# Altium schematic sheet Phase 3.SchDoc (part 1 of 4)
size Tabloid; SheetNumber: 5; SheetTotal: 7
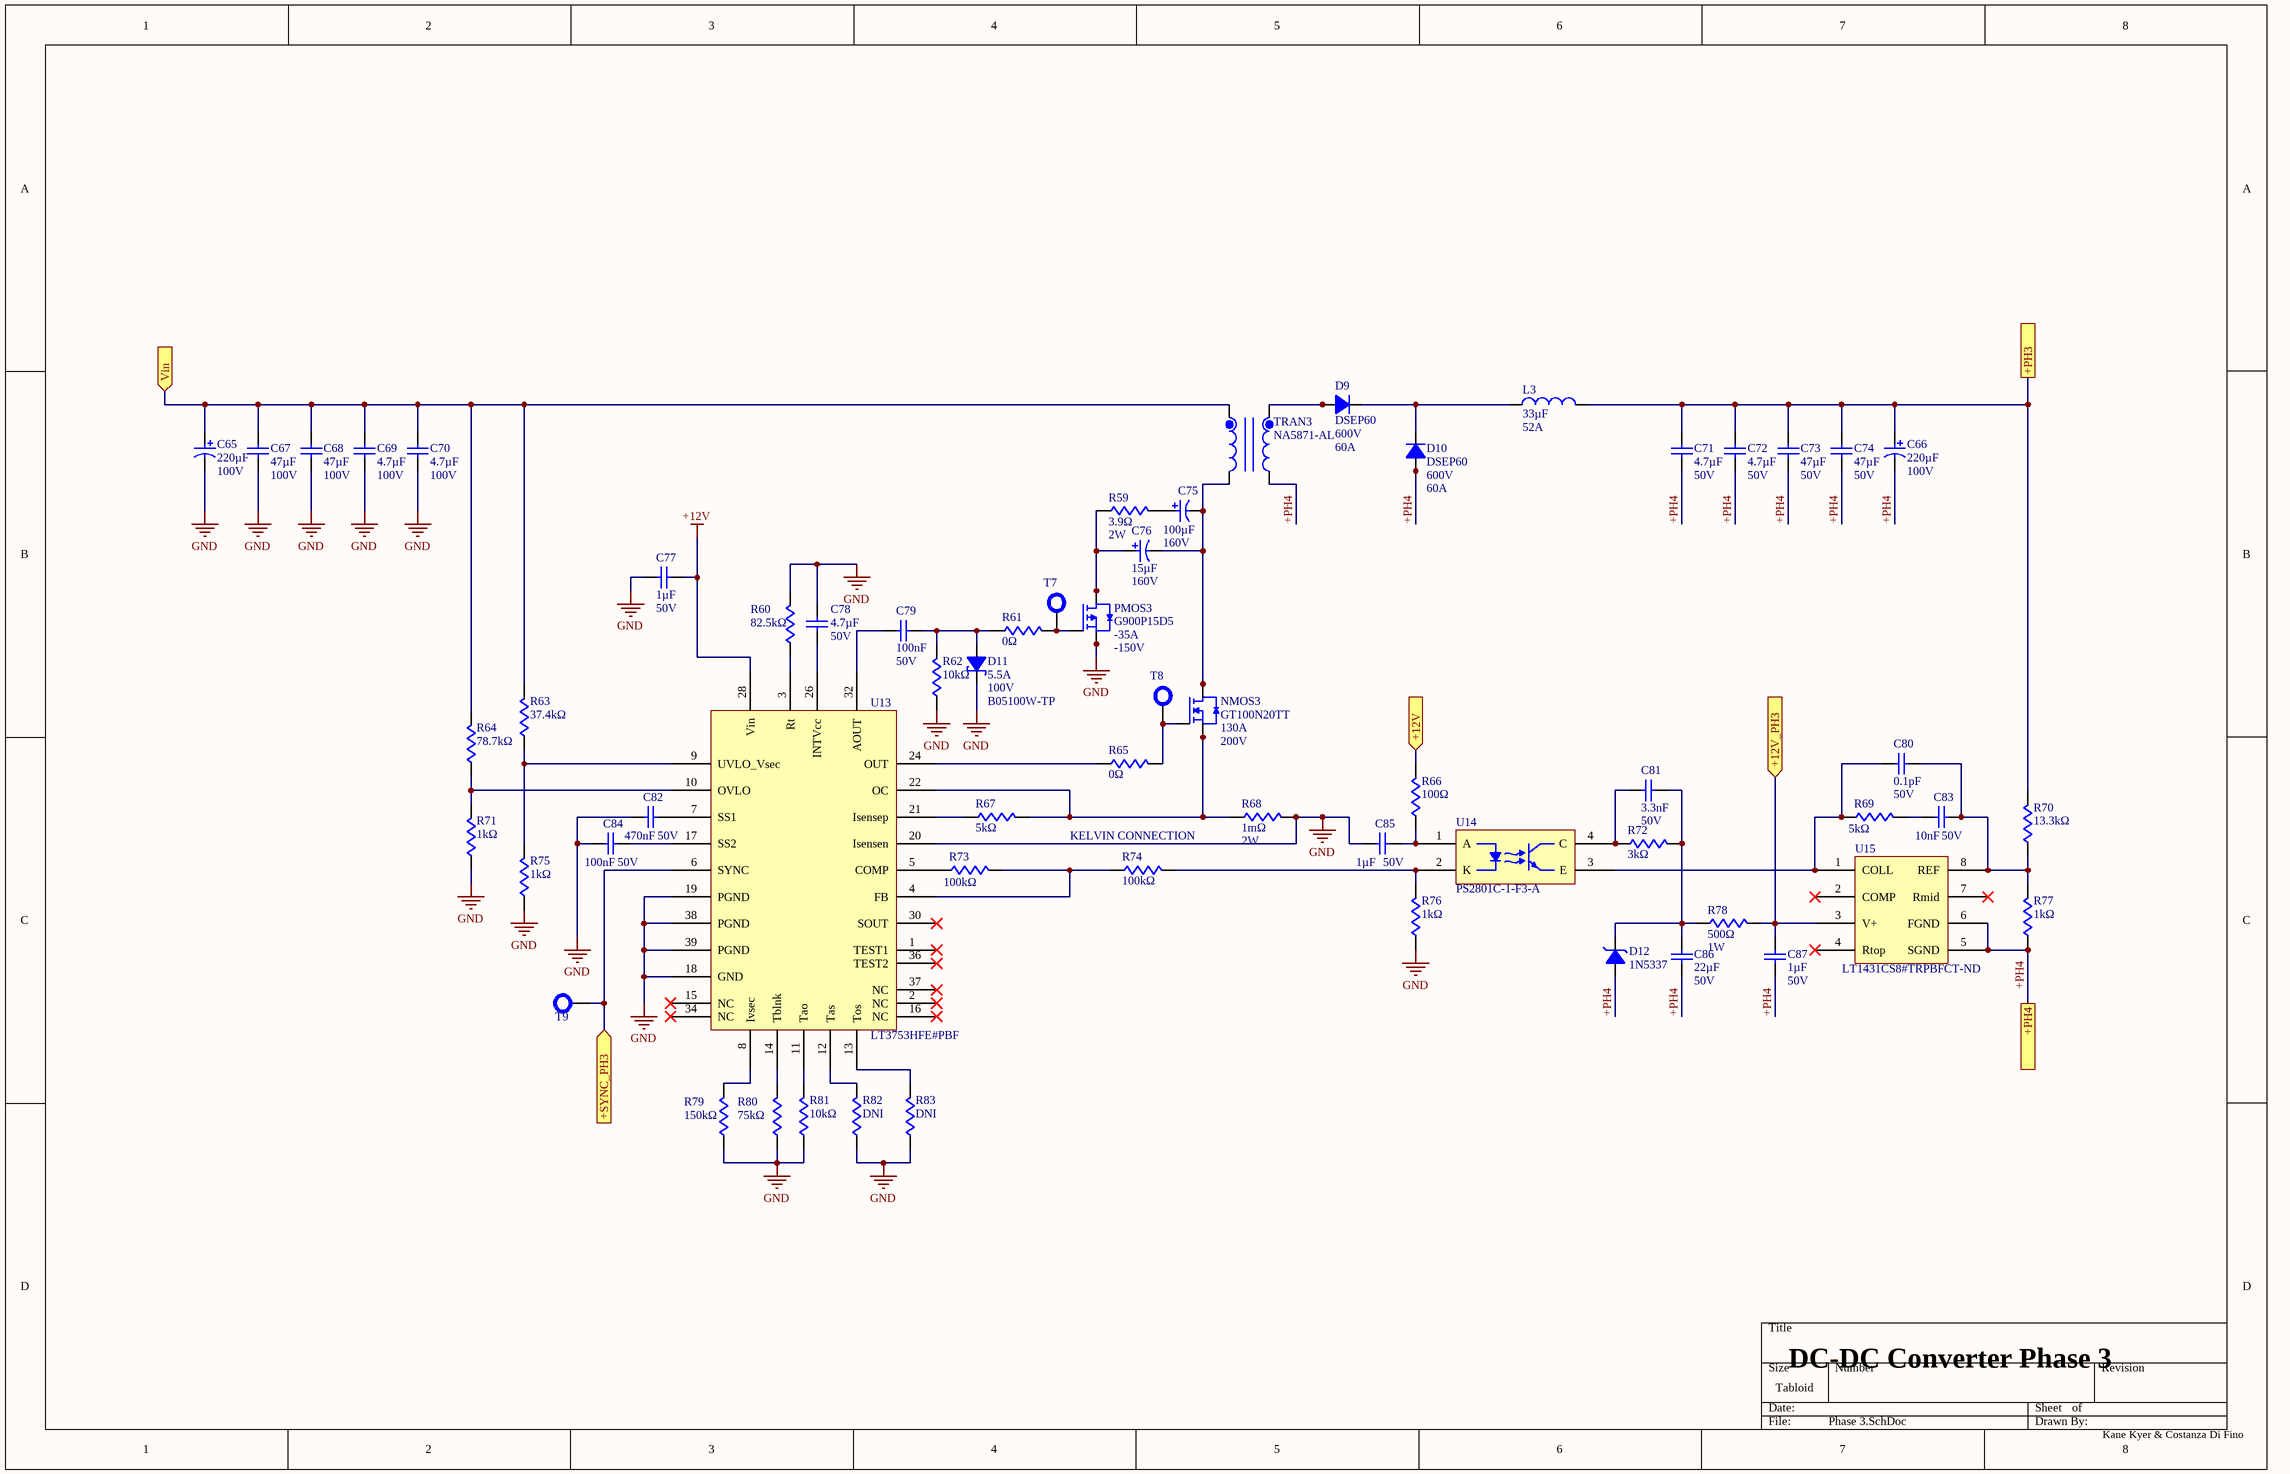
[diagram p0: Phase 3.SchDoc]

## Parts
C65  value 220µF  Voltage Rating: 100V  [C_AEC]  (hidden comment: AFK227M2AR44T-F)
C66  value 220µF  Voltage Rating: 100V  [C_AEC]  (hidden comment: AFK227M2AR44T-F)
C67  value 47µF  Voltage Rating: 100V  [C_CAA573]  (hidden comment: CAA573X7S2A476M640LH)
C68  value 47µF  Voltage Rating: 100V  [C_CAA573]  (hidden comment: CAA573X7S2A476M640LH)
C69  value 4.7µF  Voltage Rating (DC): 100V  [C_1210]  (hidden comment: GMC32X7S475K100NT)
C70  value 4.7µF  Voltage Rating (DC): 100V  [C_1210]  (hidden comment: GMC32X7S475K100NT)
C71  value 4.7µF  Voltage Rating (DC): 50V  [C_1206]  (hidden comment: GMC31X7R475K50NT)
C72  value 4.7µF  Voltage Rating (DC): 50V  [C_1206]  (hidden comment: GMC31X7R475K50NT)
C73  value 47µF  Voltage Rating (DC): 50V  [C_CKG57N]  (hidden comment: CKG57NX7R1H476M500JJ)
C74  value 47µF  Voltage Rating (DC): 50V  [C_CKG57N]  (hidden comment: CKG57NX7R1H476M500JJ)
C75  value 100µF  Voltage Rating (DC): 160V  [UUJ2C101MNJ1MS]  (hidden comment: UUJ2C101MNJ1MS)
C76  value 15µF  Voltage: 160V  [ULT2C150MNL1GS]  (hidden comment: ULT2C150MNL1GS)
C77  value 1µF  Voltage: 50V  [C_0805]  (hidden comment: CL21B105KBFNNNE)
C78  value 4.7µF  Voltage Rating (DC): 50V  [C_1206]  (hidden comment: GMC31X7R475K50NT)
C79  value 100nF  Voltage Rating: 50V  [C_0603]  (hidden comment: C0603C104K5RACTU)
C80  value 0.1pF  Voltage Rating: 50V  [C_0402]  (hidden comment: GJM1555C1HR10WB01D)
C81  value 3.3nF  Voltage Rating: 50V  [C_0603]  (hidden comment: GCM1885C1H332FA16D)
C82  value 470nF  Voltage Rating: 50V  [C_0402]  (hidden comment: GRM155R61H474KE11D)
C83  value 10nF  Voltage Rating: 50V  [C_0603]  (hidden comment: C0603C103K5RACTU)
C84  value 100nF  Voltage Rating: 50V  [C_0603]  (hidden comment: C0603C104K5RACTU)
C85  value 1µF  Voltage: 50V  [C_0805]  (hidden comment: CL21B105KBFNNNE)
C86  value 22µF  Voltage Rating (DC): 50V  [C_2220]  (hidden comment: GMC55X7R226M50NT)
C87  value 1µF  Voltage: 50V  [C_0805]  (hidden comment: CL21B105KBFNNNE)
D9  DSEP60  Vr: 600V  Io: 60A  [D_DSEP60]
D10  DSEP60  Vr: 600V  Io: 60A  [D_DSEP60]
D11  Max Forward Surge Current (Ifsm): 5.5A  Min Breakdown Voltage: 100V  [D_B05100W]  (hidden comment: B05100W-TP)
D12  Supplier Part Number: 1N5337  [D_1N5337]  (hidden comment: 1N5337BRLG)
L3  value 33µF  Irms: 52A  [CPEX4141L-330MC]  (hidden comment: CPEX4141L-330MC)
NMOS3  Id: 130A  Vds: 200V  [GT100N20TT]  (hidden comment: GT100N20TT)
PMOS3  Id: -35A  Vds: -150V  [G900P15]  (hidden comment: G900P15D5)
R59  value 3.9Ω  Power Rating: 2W  [R_SM2W]  (hidden comment: SMW23R9JT)
R60  value 82.5kΩ  [R_0805]  (hidden comment: RMCF0805FT82K5)
R61  value 0Ω  [R_0805]  (hidden comment: CRCW08050000Z0EA)
R62  value 10kΩ  [R_0402]  (hidden comment: RM04F1002CT)
R63  value 37.4kΩ  [R_0603]  (hidden comment: RC0603FR-0737K4L)
R64  value 78.7kΩ  [R_0603]  (hidden comment: RC0603FR-0778K7L)
R65  value 0Ω  [R_0805]  (hidden comment: CRCW08050000Z0EA)
R66  value 100Ω  [R_0603]  (hidden comment: RC0603FR-07100RL)
R67  value 5kΩ  [R_0402]  (hidden comment: PNM0402E5001BST1)
R68  value 1mΩ  Power Rating: 2W  [R_2512]  (hidden comment: CRE2512-FZ-R001E-2)
R69  value 5kΩ  [R_0402]  (hidden comment: PNM0402E5001BST1)
R70  value 13.3kΩ  [R_0603]  (hidden comment: RMCF0603FT13K3)
R71  value 1kΩ  [R_0402]  (hidden comment: RM04F1001CT)
R72  value 3kΩ  [C_0402]  (hidden comment: AC0402FR-073KL)
R73  value 100kΩ  [R_0402]  (hidden comment: RM04F1003CT)
R74  value 100kΩ  [R_0402]  (hidden comment: RM04F1003CT)
R75  value 1kΩ  [R_0402]  (hidden comment: RM04F1001CT)
R76  value 1kΩ  [R_0402]  (hidden comment: RM04F1001CT)
R77  value 1kΩ  [R_0402]  (hidden comment: RM04F1001CT)
R78  value 500Ω  Power Rating: 1W  [R_WSC2515]  (hidden comment: WSC2515500R0FEB)
R79  value 150kΩ  [R_0603]  (hidden comment: RC0603FR-07150KL)
R80  value 75kΩ  [R_0603]  (hidden comment: AC0603FR-0775KL)
R81  value 10kΩ  [R_0402]  (hidden comment: RM04F1002CT)
R82  value DNI  [R_0805]  (hidden comment: CRCW08050000Z0EA)
R83  value DNI  [R_0805]  (hidden comment: CRCW08050000Z0EA)
T7  TEST  [TEST_POINT]  (value not drawn)
T8  TEST  [TEST_POINT]  (value not drawn)
T9  TEST  [TEST_POINT]  (value not drawn)
TRAN3  NA5871-AL  [NA5871-AL]
U13  LT3753HFE#PBF  [LT3753]
U14  PS2801C-1-F3-A  [PS2801C]
U15  Supplier Part Number: LT1431CS8#TRPBFCT-ND  [LT1431]  (hidden comment: LT1431CS8#TRPBF)

## Ports
+12V (in, see SHEET_MAP[4C], Externals[2A], Phase 1[4C], Phase 2[4C], Phase 4[4C], Phase 5[4B]), +12V_PH3 (in, see SHEET_MAP[4C], Externals[6B]), +PH3 (see SHEET_MAP[4B], Externals[4C], Phase 2[6C]), +PH4 (see SHEET_MAP[4C], Externals[6B], Phase 4[6B]), +SYNC_PH3 (in, see SHEET_MAP[4C], Externals[3C]), Vin (in, see SHEET_MAP[4B], Externals[1A], Phase 1[1B], Phase 2[1B], Phase 4[1B], Phase 5[1B])

## Nets
+12V: C77.2 U13.28(Vin)
GND: C65.2 C67.1 C68.1 C69.1 C70.1 C77.1 C78.1 C82.1 C84.1 C85.1 D11.1 PMOS3.1(S) PMOS3.2(S) PMOS3.3(S) R60.2 R62.1 R68.2 R71.1 R75.1 R76.1 R79.1 R80.1 R81.1 R82.1 R83.1 U13.18(GND) U13.19(PGND) U13.20(Isensen) U13.38(PGND) U13.39(PGND)
+12V: R66.2 ; port +12V  [a separate net that carries the same name]
+12V_PH3: C87.2 R78.2 U15.3(V+) ; port +12V_PH3
+PH3: C66.1 C71.2 C72.2 C73.2 C74.2 L3.2 R70.2 ; port +PH3
+PH4: C66.2 C71.1 C72.1 C73.1 C74.1 C86.1 C87.1 D10.1(A) D10.3(A) D12.2 R77.1 TRAN3.11 U15.5(SGND) U15.6(FGND) ; port +PH4
+SYNC_PH3: T9.1 U13.6(SYNC) ; port +SYNC_PH3
Vin: C65.1 C67.2 C68.2 C69.2 C70.2 R63.2 R64.2 TRAN3.1 ; port Vin
NetC75_1: C75.1 R59.2
NetC75_2: C75.2 C76.2 NMOS3.9(D) NMOS3.10(D) NMOS3.11(D) NMOS3.12(D) NMOS3.13(D) NMOS3.14(D) NMOS3.15(D) NMOS3.16(D) TRAN3.4
NetC76_1: C76.1 PMOS3.5(D) PMOS3.6(D) PMOS3.7(D) PMOS3.8(D) R59.1
NetC78_2: C78.2 U13.26(INTVcc)
NetC79_1: C79.1 U13.32(AOUT)
NetC79_2: C79.2 D11.2 R61.1 R62.2
NetC80_1: C80.1 R69.1 U14.3(E) U15.1(COLL)
NetC80_2: C80.2 C83.2 R70.1 R77.2 U15.8(REF)
NetC81_1: C81.1 R72.1 U14.4(C)
NetC81_2: C81.2 C86.2 D12.1 R72.2 R78.1
NetC82_2: C82.2 U13.7(SS1)
NetC83_1: C83.1 R69.2
NetC84_2: C84.2 U13.17(SS2)
NetC85_2: C85.2 R66.1 U14.1(A)
NetD9_1: D9.1(A) D9.3(A) TRAN3.6
NetD9_4: D9.4(C) D10.4(C) L3.1
NetNMOS3_1: NMOS3.1(S) NMOS3.2(S) NMOS3.3(S) NMOS3.4(S) NMOS3.5(S) NMOS3.6(S) NMOS3.7(S) R67.2 R68.1 U13.22(OC)
NetNMOS3_8: NMOS3.8(G) R65.2 T8.1
NetPMOS3_4: PMOS3.4(G) R61.2 T7.1
NetR60_1: R60.1 U13.3(Rt)
NetR63_1: R63.1 R75.2 U13.9(UVLO_Vsec)
NetR64_1: R64.1 R71.2 U13.10(OVLO)
NetR65_1: R65.1 U13.24(OUT)
NetR67_1: R67.1 U13.21(Isensep)
NetR73_1: R73.1 U13.5(COMP)
NetR73_2: R73.2 R74.1 U13.4(FB)
NetR74_2: R74.2 R76.2 U14.2(K)
NetR79_2: R79.2 U13.8(Ivsec)
NetR80_2: R80.2 U13.14(Tblnk)
NetR81_2: R81.2 U13.11(Tao)
NetR82_2: R82.2 U13.12(Tas)
NetR83_2: R83.2 U13.13(Tos)

Not connected (* = marked no-connect by the designer): U13 1(TEST1)* 2(NC)* 15(NC)* 16(NC)* 30(SOUT)* 34(NC)* 36(TEST2)* 37(NC)*; U15 2(COMP)* 4(Rtop)* 7(Rmid)*

## Notes on the sheet
- (near R74) KELVIN CONNECTION
- DC-DC Converter Phase 3
- Kane Kyer & Costanza Di Fino
## Library data of the parts
C65 C66 = AFK227M2AR44T-F: Radial Can - SMD ALUMINUM ELECTROLYTIC CAPACITOR AFK 100V 220muF ±20% 0.709Dia 18.00mm; Manufacturer: Cornell Dubilier; Dissipation Factor: 0.07%; ESR (Equivalent Series Resistance): 150mΩ; Leakage Current: 220µA; Life (Hours): 5000hours; Ripple Current: 687.75mA; Ripple Current (AC): 917mA; Supplier: DigiKey; Supplier Part Number: 338-2172-1-ND; Manufacturer Part Number: AFK227M2AR44T-F; RoHS: Compliant; Category: Aluminum Electrolytic Capacitors; Stock: 15469; Pricing: 1=5.21, 10=3.565, 50=2.9248 (USD); Case/Package: Radial; Diameter: 18mm; Height: 16.5mm; Height - Seated (Max): 16.51mm; Impedance: 150mΩ; Lead Pitch: 6.7mm; Length: 21mm; Lifecycle Status: Production; Max Operating Temperature: 105°C; Min Operating Temperature: -55°C; Mounting Technology: Surface Mount; Number of Terminals: 2; Packaging: Tape & Reel; Radiation Hardening: No; REACH SVHC: Yes; Schedule B: 8532220020, 8532220020|8532220020|8532220020|8532220020|8532220020; Termination: SMD/SMT; Tolerance: 20%; Voltage Rating (DC): 100V; Width: 19mm; ComponentLink1URL: https://datasheet.octopart.com:443/AFK227M2AR44T-F-Cornell-Dubilier-datasheet-166322649.pdf?src-supplier=Master+Electronics; ComponentLink1Description: https://datasheet.octopart.com:443/AFK227M2AR44T-F-Cornell-Dubilier-datasheet-166322649.pdf?src-supplier=Master+Electronics; ComponentLink2URL: https://datasheet.octopart.com:443/AFK227M2AR44T-F-Cornell-Dubilier-datasheet-138156812.pdf?src-supplier=Master+Electronics; ComponentLink2Description: https://datasheet.octopart.com:443/AFK227M2AR44T-F-Cornell-Dubilier-datasheet-138156812.pdf?src-supplier=Master+Electronics; ComponentLink3URL: https://datasheet.octopart.com:443/AFK227M2AR44T-F-Cornell-Dubilier-datasheet-142087090.pdf?src-supplier=JRH+Electronics; ComponentLink3Description: https://datasheet.octopart.com:443/AFK227M2AR44T-F-Cornell-Dubilier-datasheet-142087090.pdf?src-supplier=JRH+Electronics; ComponentLink4URL: https://datasheet.octopart.com:443/AFK227M2AR44T-F-Cornell-Dubilier-datasheet-8399120.pdf?src-supplier=Newark; ComponentLink4Description: https://datasheet.octopart.com:443/AFK227M2AR44T-F-Cornell-Dubilier-datasheet-8399120.pdf?src-supplier=Newark; ComponentLink5URL: https://datasheet.octopart.com:443/AFK227M2AR44T-F-Cornell-Dubilier-datasheet-500115.pdf?src-supplier=Newark; ComponentLink5Description: https://datasheet.octopart.com:443/AFK227M2AR44T-F-Cornell-Dubilier-datasheet-500115.pdf?src-supplier=Newark; ComponentLink6URL: https://datasheet.octopart.com:443/AFK227M2AR44T-F-Cornell-Dubilier-datasheet-32747259.pdf?src-supplier=Newark; ComponentLink6Description: https://datasheet.octopart.com:443/AFK227M2AR44T-F-Cornell-Dubilier-datasheet-32747259.pdf?src-supplier=Newark; ComponentLink7URL: https://datasheet.octopart.com:443/AFK227M2AR44T-F-Cornell-Dubilier-datasheet-151943046.pdf?src-supplier=RS+(Formerly+Allied+Electronics); ComponentLink7Description: https://datasheet.octopart.com:443/AFK227M2AR44T-F-Cornell-Dubilier-datasheet-151943046.pdf?src-supplier=RS+(Formerly+Allied+Electronics); ComponentLink8URL: https://datasheet.octopart.com:443/AFK227M2AR44T-F-Cornell-Dubilier-datasheet-140352836.pdf?src-supplier=Sager+Electronics; ComponentLink8Description: https://datasheet.octopart.com:443/AFK227M2AR44T-F-Cornell-Dubilier-datasheet-140352836.pdf?src-supplier=Sager+Electronics; ComponentLink9URL: https://datasheet.octopart.com:443/AFK227M2AR44T-F-Cornell-Dubilier-datasheet-67811900.pdf?src-supplier=Sager+Electronics; ComponentLink9Description: https://datasheet.octopart.com:443/AFK227M2AR44T-F-Cornell-Dubilier-datasheet-67811900.pdf?src-supplier=Sager+Electronics; ComponentLink10URL: http://sigma.octopart.com:80/conflict_mineral_statement/Cornell-Dubilier-company-37.pdf?src-supplier=Compliance+Statements; ComponentLink10Description: http://sigma.octopart.com:80/conflict_mineral_statement/Cornell-Dubilier-company-37.pdf?src-supplier=Compliance+Statements
C67 C68 = CAA573X7S2A476M640LH: Multilayer Ceramic Chip Capacitors, Capacitance=47μF, LxWxT: 6.0x7.5x6.4mm; Manufacturer: TDK; Manufacturer Lifecycle Status: PRODUCTION; Tolerance: 20%; Supplier: DigiKey; Supplier Part Number: 445-CAA573X7S2A476M640LHDKR-ND; Manufacturer Part Number: CAA573X7S2A476M640LH; RoHS: Compliant; Category: Ceramic Capacitors; Stock: 24473; Pricing: 1=10.27, 10=7.818, 50=6.838, 100=6.579 (USD); China RoHS: Compliant; Dielectric Material: Ceramic; Height: 6.4mm; Length: 6mm; Lifecycle Status: Production; Material: Ceramic; Max Length: 6.5mm; Max Operating Temperature: 125°C; Max Width: 8mm; Min Length: 5.5mm; Min Operating Temperature: -55°C; Min Width: 7mm; Mounting Technology: Surface Mount; Number of Terminals: 2; REACH SVHC: Yes; Voltage Rating (DC): 100V; Width: 7.5mm; ComponentLink1URL: https://datasheet.octopart.com:443/CAA573X7S2A476M640LH-TDK-datasheet-182135103.pdf?src-supplier=IHS; ComponentLink1Description: https://datasheet.octopart.com:443/CAA573X7S2A476M640LH-TDK-datasheet-182135103.pdf?src-supplier=IHS; ComponentLink2URL: https://datasheet.octopart.com:443/CAA573X7S2A476M640LH-TDK-datasheet-155377011.pdf?src-supplier=TDK; ComponentLink2Description: https://datasheet.octopart.com:443/CAA573X7S2A476M640LH-TDK-datasheet-155377011.pdf?src-supplier=TDK; ComponentLink3URL: https://datasheet.octopart.com:443/CAA573X7S2A476M640LH-TDK-datasheet-153441511.pdf?src-supplier=Newark; ComponentLink3Description: https://datasheet.octopart.com:443/CAA573X7S2A476M640LH-TDK-datasheet-153441511.pdf?src-supplier=Newark; ComponentLink4URL: https://datasheet.octopart.com:443/CAA573X7S2A476M640LH-TDK-datasheet-168137603.pdf?src-supplier=TME; ComponentLink4Description: https://datasheet.octopart.com:443/CAA573X7S2A476M640LH-TDK-datasheet-168137603.pdf?src-supplier=TME
C69 C70 = GMC32X7S475K100NT: Ceramic Capacitor, Multilayer, Ceramic, 100V, 10% +Tol, 10% -Tol, X7S, 22% TC, 4.7uF, Surface Mount, 1210; Manufacturer: Cal-Chip Electronics; Supplier: DigiKey; Supplier Part Number: 4713-GMC32X7S475K100NTCT-ND; Manufacturer Part Number: GMC32X7S475K100NT; RoHS: Compliant; Category: Ceramic Capacitors; Stock: 7871; Pricing: 1=0.78, 10=0.493, 50=0.3784, 100=0.3432, 500=0.28388, 1000=0.26553, 2000=0.25043, 3000=0.24286, 5000=0.23448, 7000=0.22958, 10000=0.22487, 12000=0.22264, 24000=0.21512, 25000=0.21472 (USD); China RoHS: Compliant; Country of Origin: Slovenia, South Korea, Taiwan; Dielectric Material: Ceramic; Export Control Classification Number (ECCN) Code: EAR99; Height: 2.8mm; Harmonized Tariff Schedule (HTS) Code: 8532.24.00.20; Introduction Date: 2022-02-23; Length: 3.2mm; Lifecycle Status: Production; Max Operating Temperature: 125°C; Min Operating Temperature: -55°C; Mounting Technology: Surface Mount; Number of Terminals: 2; REACH SVHC: Yes; Width: 2.5mm; ComponentLink1URL: https://datasheet.octopart.com:443/GMC32X7S475K100NT-Cal-Chip-Electronics-datasheet-182028817.pdf?src-supplier=IHS; ComponentLink1Description: https://datasheet.octopart.com:443/GMC32X7S475K100NT-Cal-Chip-Electronics-datasheet-182028817.pdf?src-supplier=IHS
C71 C72 C78 = GMC31X7R475K50NT: Ceramic Capacitor, Multilayer, Ceramic, 50V, 10% +Tol, 10% -Tol, X7R, 15% TC, 4.7uF, Surface Mount, 1206; Manufacturer: Cal-Chip Electronics; Supplier: DigiKey; Supplier Part Number: 4713-GMC31X7R475K50NTCT-ND; Manufacturer Part Number: GMC31X7R475K50NT; RoHS: Compliant; Category: Ceramic Capacitors; Stock: 34176; Pricing: 1=0.3, 10=0.176, 50=0.128, 100=0.1133, 500=0.08864, 1000=0.08105 (USD); China RoHS: Compliant; Country of Origin: Slovenia, South Korea, Taiwan; Dielectric Material: Ceramic; Export Control Classification Number (ECCN) Code: EAR99; Height: 1.9mm; Harmonized Tariff Schedule (HTS) Code: 8532.24.00.20; Introduction Date: 2018-03-20; Length: 3.2mm; Lifecycle Status: Production; Max Operating Temperature: 125°C; Min Operating Temperature: -55°C; Mounting Technology: Surface Mount; Number of Terminals: 2; REACH SVHC: Yes; Width: 1.6mm; ComponentLink1URL: https://datasheet.octopart.com:443/GMC31X7R475K50NT-Cal-Chip-Electronics-datasheet-182028815.pdf?src-supplier=IHS; ComponentLink1Description: https://datasheet.octopart.com:443/GMC31X7R475K50NT-Cal-Chip-Electronics-datasheet-182028815.pdf?src-supplier=IHS
C73 C74 = CKG57NX7R1H476M500JJ: Ceramic Capacitor, Multilayer, Ceramic, 50V, 20% +Tol, 20% -Tol, X7R, 15% TC, 47uF, Surface Mount, 2420; Manufacturer: TDK; Manufacturer Lifecycle Status: PRODUCTION; Supplier: DigiKey; Supplier Part Number: 445-CKG57NX7R1H476M500JJCT-ND; Manufacturer Part Number: CKG57NX7R1H476M500JJ; RoHS: Compliant; Category: Ceramic Capacitors; Stock: 11597; Pricing: 1=9.3, 10=7.032, 50=6.1256, 100=5.845, 500=5.8293 (USD); China RoHS: Compliant; Dielectric Material: Ceramic; Height: 5mm; Length: 6mm; Lifecycle Status: Production; Max Length: 6.5mm; Max Operating Temperature: 125°C; Max Width: 5.5mm; Min Length: 5.5mm; Min Operating Temperature: -55°C; Min Width: 4.5mm; Mounting Technology: Surface Mount; Number of Terminals: 2; REACH SVHC: Yes; Width: 5mm; ComponentLink1URL: https://datasheet.octopart.com:443/CKG57NX7R1H476M500JJ-TDK-datasheet-181961982.pdf?src-supplier=IHS; ComponentLink1Description: https://datasheet.octopart.com:443/CKG57NX7R1H476M500JJ-TDK-datasheet-181961982.pdf?src-supplier=IHS; ComponentLink2URL: https://datasheet.octopart.com:443/CKG57NX7R1H476M500JJ-TDK-datasheet-151651377.pdf?src-supplier=Future+Electronics; ComponentLink2Description: https://datasheet.octopart.com:443/CKG57NX7R1H476M500JJ-TDK-datasheet-151651377.pdf?src-supplier=Future+Electronics; ComponentLink3URL: https://datasheet.octopart.com:443/CKG57NX7R1H476M500JJ-TDK-datasheet-182135362.pdf?src-supplier=TME; ComponentLink3Description: https://datasheet.octopart.com:443/CKG57NX7R1H476M500JJ-TDK-datasheet-182135362.pdf?src-supplier=TME; ComponentLink4URL: https://datasheet.octopart.com:443/CKG57NX7R1H476M500JJ-TDK-datasheet-165812700.pdf?src-supplier=ODG+(Origin+Data+Global); ComponentLink4Description: https://datasheet.octopart.com:443/CKG57NX7R1H476M500JJ-TDK-datasheet-165812700.pdf?src-supplier=ODG+(Origin+Data+Global)
C75 = UUJ2C101MNJ1MS: Aluminum Electrolytic Capacitors 100 F 160 V Radial, SMD 5000 Hrs 105C; Manufacturer: Nichicon; Leakage Current: 740µA; Ripple Current: 380mA; Supplier: DigiKey; Supplier Part Number: 493-UUJ2C101MNJ1MSCT-ND; Manufacturer Part Number: UUJ2C101MNJ1MS; RoHS: Compliant; Category: Aluminum Electrolytic Capacitors; Stock: 7193; Pricing: 1=2.95, 10=1.68 (USD); China RoHS: Compliant; Diameter: 16mm; Height: 21.5mm; Length: 17.1mm; Lifecycle Status: Production; Max Operating Temperature: 105°C; Min Operating Temperature: -40°C; Mounting Technology: Surface Mount; Number of Terminals: 2; REACH SVHC: No; Width: 17.1mm; ComponentLink1URL: https://datasheet.octopart.com:443/UUJ2C101MNJ1MS-Nichicon-datasheet-169250491.pdf?src-supplier=IHS; ComponentLink1Description: https://datasheet.octopart.com:443/UUJ2C101MNJ1MS-Nichicon-datasheet-169250491.pdf?src-supplier=IHS
C76 = ULT2C150MNL1GS: Radial Can - SMD ALUMINUM ELECTROLYTIC CAPACITOR ULT 160V 15muF ±20% 0.315Dia 8.00mm; Manufacturer: Nichicon; Leakage Current: 196µA; Life (Hours): 2000hours; Polarity: Polar; Ripple Current: 45mA; Supplier: DigiKey; Supplier Part Number: 493-6717-1-ND; Manufacturer Part Number: ULT2C150MNL1GS; RoHS: Compliant; Category: Aluminum Electrolytic Capacitors; Stock: 26934; Pricing: 1=0.99, 10=0.603, 50=0.4768, 100=0.4287 (USD); Case/Package: SMD/SMT; China RoHS: Compliant; Diameter: 8mm; Height: 10mm; Height - Seated (Max): 10.3124mm; Lead Pitch: 3.1mm; Length: 8.3mm; Lifecycle Status: Production; Max Operating Temperature: 125°C; Min Operating Temperature: -40°C; Mounting Technology: Surface Mount; Number of Terminals: 2; REACH SVHC: No; Ripple Current (AC): 45mA; Schedule B: 8532220020; Termination: SMD/SMT; Tolerance: 20%; Voltage Rating: 160V; Voltage Rating (DC): 160V; Weight: 799.995193mg; Width: 8.3mm; ComponentLink1URL: https://datasheet.octopart.com:443/ULT2C150MNL1GS-Nichicon-datasheet-169691395.pdf?src-supplier=IHS; ComponentLink1Description: https://datasheet.octopart.com:443/ULT2C150MNL1GS-Nichicon-datasheet-169691395.pdf?src-supplier=IHS; ComponentLink2URL: https://datasheet.octopart.com:443/ULT2C150MNL1GS-Nichicon-datasheet-141421453.pdf?src-supplier=ODG+(Origin+Data+Global); ComponentLink2Description: https://datasheet.octopart.com:443/ULT2C150MNL1GS-Nichicon-datasheet-141421453.pdf?src-supplier=ODG+(Origin+Data+Global); ComponentLink3URL: https://datasheet.octopart.com:443/ULT2C150MNL1GS-Nichicon-datasheet-83187986.pdf?src-supplier=TME; ComponentLink3Description: https://datasheet.octopart.com:443/ULT2C150MNL1GS-Nichicon-datasheet-83187986.pdf?src-supplier=TME
C77 C85 C87 = CL21B105KBFNNNE: 50V 1uF X7R ±10% 0805 Multilayer Ceramic Capacitors MLCC - SMD/SMT ROHS; Manufacturer: Samsung Electro-Mechanics; Supplier: DigiKey; Supplier Part Number: 1276-1029-6-ND; Manufacturer Part Number: CL21B105KBFNNNE; RoHS: Compliant; Category: Ceramic Capacitors; Stock: 1737555; Pricing: 1=0.08, 10=0.013 (USD); Case/Package: 0805; Case Code (Imperial): 0805; Case Code (Metric): 2012; China RoHS: Compliant; Country of Origin: Mainland China, Philippines, South Korea; Depth: 1.25mm; Dielectric: X7R; Dielectric Material: Ceramic; Export Control Classification Number (ECCN) Code: EAR99; Height: 1.35mm; Harmonized Tariff Schedule (HTS) Code: 8532.24.00.20; Introduction Date: 2010-07-30; Length: 2mm; Lifecycle Status: Production; Material: Ceramic; Max Operating Temperature: 125°C; Min Operating Temperature: -55°C; Mounting Technology: Surface Mount; Number of Terminals: 2; Radiation Hardening: No; REACH SVHC: Yes; Schedule B: 8532240020, 8532240020|8532240020, 8532240020|8532240020|8532240020, 8532240020|8532240020|8532240020|8532240020; Thickness: 1.3462mm; Tolerance: 10%; Voltage Rating: 50V; Voltage Rating (DC): 50V; Width: 1.25mm; ComponentLink1URL: https://datasheet.octopart.com:443/CL21B105KBFNNNE-Samsung-Electro-Mechanics-datasheet-136482495.pdf?src-supplier=IHS; ComponentLink1Description: https://datasheet.octopart.com:443/CL21B105KBFNNNE-Samsung-Electro-Mechanics-datasheet-136482495.pdf?src-supplier=IHS; ComponentLink2URL: https://datasheet.octopart.com:443/CL21B105KBFNNNE-Samsung-Electro-Mechanics-datasheet-11733377.pdf?src-supplier=Future+Electronics; ComponentLink2Description: https://datasheet.octopart.com:443/CL21B105KBFNNNE-Samsung-Electro-Mechanics-datasheet-11733377.pdf?src-supplier=Future+Electronics; ComponentLink3URL: https://datasheet.octopart.com:443/CL21B105KBFNNNE-Samsung-Electro-Mechanics-datasheet-116891038.pdf?src-supplier=Future+Electronics; ComponentLink3Description: https://datasheet.octopart.com:443/CL21B105KBFNNNE-Samsung-Electro-Mechanics-datasheet-116891038.pdf?src-supplier=Future+Electronics; ComponentLink4URL: https://datasheet.octopart.com:443/CL21B105KBFNNNE-Samsung-Electro-Mechanics-datasheet-81462183.pdf?src-supplier=Future+Electronics; ComponentLink4Description: https://datasheet.octopart.com:443/CL21B105KBFNNNE-Samsung-Electro-Mechanics-datasheet-81462183.pdf?src-supplier=Future+Electronics; ComponentLink5URL: https://datasheet.octopart.com:443/CL21B105KBFNNNE-Samsung-datasheet-48647582.pdf?src-supplier=Future+Electronics; ComponentLink5Description: https://datasheet.octopart.com:443/CL21B105KBFNNNE-Samsung-datasheet-48647582.pdf?src-supplier=Future+Electronics; ComponentLink6URL: https://datasheet.octopart.com:443/CL21B105KBFNNNE-Samsung-datasheet-8326294.pdf?src-supplier=Future+Electronics; ComponentLink6Description: https://datasheet.octopart.com:443/CL21B105KBFNNNE-Samsung-datasheet-8326294.pdf?src-supplier=Future+Electronics; ComponentLink7URL: https://datasheet.octopart.com:443/CL21B105KBFNNNE-Samsung-Electro-Mechanics-datasheet-149045959.pdf?src-supplier=Future+Electronics; ComponentLink7Description: https://datasheet.octopart.com:443/CL21B105KBFNNNE-Samsung-Electro-Mechanics-datasheet-149045959.pdf?src-supplier=Future+Electronics; ComponentLink8URL: https://datasheet.octopart.com/CL21B105KBFNNNE-Samsung-Electro-Mechanics-datasheet-97040617.pdf; ComponentLink8Description: https://datasheet.octopart.com/CL21B105KBFNNNE-Samsung-Electro-Mechanics-datasheet-97040617.pdf; ComponentLink9URL: https://datasheet.octopart.com/CL21B105KBFNNNE-Samsung-Electro-Mechanics-datasheet-8324245.pdf; ComponentLink9Description: https://datasheet.octopart.com/CL21B105KBFNNNE-Samsung-Electro-Mechanics-datasheet-8324245.pdf; ComponentLink10URL: https://datasheet.octopart.com/General-Multilayer-Ceramic-Capacitors-Samsung-datasheet-family-111.pdf; ComponentLink10Description: https://datasheet.octopart.com/General-Multilayer-Ceramic-Capacitors-Samsung-datasheet-family-111.pdf; ComponentLink11URL: https://datasheet.octopart.com:443/CL21B105KBFNNNE-Samsung-datasheet-59220082.pdf?src-supplier=TME; ComponentLink11Description: https://datasheet.octopart.com:443/CL21B105KBFNNNE-Samsung-datasheet-59220082.pdf?src-supplier=TME; ComponentLink12URL: http://sigma.octopart.com:80/rohs_certificate/General-Multilayer-Ceramic-Capacitors-Samsung-family-110.pdf?src-supplier=Compliance+Statements; ComponentLink12Description: http://sigma.octopart.com:80/rohs_certificate/General-Multilayer-Ceramic-Capacitors-Samsung-family-110.pdf?src-supplier=Compliance+Statements; ComponentLink13URL: http://sigma.octopart.com:80/rohs_statement/General-Multilayer-Ceramic-Capacitors-Samsung-family-132.pdf?src-supplier=Compliance+Statements; ComponentLink13Description: http://sigma.octopart.com:80/rohs_statement/General-Multilayer-Ceramic-Capacitors-Samsung-family-132.pdf?src-supplier=Compliance+Statements; ComponentLink14URL: http://sigma.octopart.com:80/reach_statement/General-Multilayer-Ceramic-Capacitors-Samsung-family-133.pdf?src-supplier=Compliance+Statements; ComponentLink14Description: http://sigma.octopart.com:80/reach_statement/General-Multilayer-Ceramic-Capacitors-Samsung-family-133.pdf?src-supplier=Compliance+Statements
C79 C84 = C0603C104K5RACTU: 50V 100nF X7R ±10% 0603 Multilayer Ceramic Capacitors MLCC - SMD/SMT ROHS; Manufacturer: KEMET; Dissipation Factor: 2.5%; Temperature Coefficient: 30ppm/°C; Supplier: DigiKey; Supplier Part Number: 399-C0603C104K5RACTUCT-ND; Manufacturer Part Number: C0603C104K5RACTU; RoHS: Compliant; Category: Ceramic Capacitors; Stock: 12452103; Pricing: 1=0.08, 10=0.011 (USD); Case/Package: 0603; Case Code (Imperial): 0603; China RoHS: Compliant; Contact Plating: Tin; Country of Origin: Mexico; Depth: 800µm; Dielectric: X7R; Dielectric Material: Ceramic; Export Control Classification Number (ECCN) Code: EAR99; Height: 800µm; Harmonized Tariff Schedule (HTS) Code: 8532.24.00.20; Introduction Date: 2011-07-27; Lead Free: Lead Free; Lead Pitch: 700µm; Length: 1.6mm; Lifecycle Status: Production; Material: Ceramic; Max Operating Temperature: 125°C; Min Operating Temperature: -55°C; Mounting Technology: Surface Mount; Pins: 2; Number of Terminals: 2; Packaging: Tape & Reel; Radiation Hardening: No; REACH SVHC: Yes; Schedule B: 8532240020, 8532240020|8532240020, 8532240020|8532240020|8532240020, 8532240020|8532240020|8532240020|8532240020; Termination: SMD/SMT; Thickness: 863.6µm; Tolerance: 10%; Voltage: 50V; Voltage Rating (DC): 50V; Width: 800µm; ComponentLink1URL: https://datasheet.octopart.com:443/C0603C104K5RACTU-KEMET-datasheet-178445679.pdf?src-supplier=IHS; ComponentLink1Description: https://datasheet.octopart.com:443/C0603C104K5RACTU-KEMET-datasheet-178445679.pdf?src-supplier=IHS; ComponentLink2URL: https://datasheet.octopart.com:443/C0603C104K5RAC7867-KEMET-datasheet-184792804.pdf?src-supplier=IHS; ComponentLink2Description: https://datasheet.octopart.com:443/C0603C104K5RAC7867-KEMET-datasheet-184792804.pdf?src-supplier=IHS; ComponentLink3URL: https://datasheet.octopart.com:443/C0603C104K5RACTU-KEMET-datasheet-137357759.pdf?src-supplier=Farnell; ComponentLink3Description: https://datasheet.octopart.com:443/C0603C104K5RACTU-KEMET-datasheet-137357759.pdf?src-supplier=Farnell; ComponentLink4URL: https://datasheet.octopart.com:443/C0603C104K5RACTU-KEMET-datasheet-149521864.pdf?src-supplier=Farnell; ComponentLink4Description: https://datasheet.octopart.com:443/C0603C104K5RACTU-KEMET-datasheet-149521864.pdf?src-supplier=Farnell; ComponentLink5URL: https://datasheet.octopart.com:443/C0603C104K5RACTU-KEMET-datasheet-101575654.pdf?src-supplier=Farnell; ComponentLink5Description: https://datasheet.octopart.com:443/C0603C104K5RACTU-KEMET-datasheet-101575654.pdf?src-supplier=Farnell; ComponentLink6URL: https://datasheet.octopart.com:443/C0603C104K5RACTU-KEMET-datasheet-176142159.pdf?src-supplier=Farnell; ComponentLink6Description: https://datasheet.octopart.com:443/C0603C104K5RACTU-KEMET-datasheet-176142159.pdf?src-supplier=Farnell; ComponentLink7URL: https://datasheet.octopart.com:443/C0603C104K5RAC-TU-Kemet-datasheet-7833651.pdf?src-supplier=Farnell; ComponentLink7Description: https://datasheet.octopart.com:443/C0603C104K5RAC-TU-Kemet-datasheet-7833651.pdf?src-supplier=Farnell; ComponentLink8URL: https://datasheet.octopart.com:443/C0603C104K5RAC-TU-Kemet-datasheet-7601896.pdf?src-supplier=Farnell; ComponentLink8Description: https://datasheet.octopart.com:443/C0603C104K5RAC-TU-Kemet-datasheet-7601896.pdf?src-supplier=Farnell; ComponentLink9URL: https://datasheet.octopart.com:443/C0603C104K5RAC-TU-Kemet-datasheet-5316294.pdf?src-supplier=Farnell; ComponentLink9Description: https://datasheet.octopart.com:443/C0603C104K5RAC-TU-Kemet-datasheet-5316294.pdf?src-supplier=Farnell; ComponentLink10URL: https://datasheet.octopart.com:443/C0603C104K5RAC-TU-Kemet-datasheet-5314837.pdf?src-supplier=Farnell; ComponentLink10Description: https://datasheet.octopart.com:443/C0603C104K5RAC-TU-Kemet-datasheet-5314837.pdf?src-supplier=Farnell; ComponentLink11URL: https://datasheet.octopart.com:443/C0603C104K5RAC-TU-Kemet-datasheet-8092359.pdf?src-supplier=Farnell; ComponentLink11Description: https://datasheet.octopart.com:443/C0603C104K5RAC-TU-Kemet-datasheet-8092359.pdf?src-supplier=Farnell; ComponentLink12URL: https://datasheet.octopart.com:443/C0603C104K5RAC-TU-Kemet-datasheet-5314449.pdf?src-supplier=Farnell; ComponentLink12Description: https://datasheet.octopart.com:443/C0603C104K5RAC-TU-Kemet-datasheet-5314449.pdf?src-supplier=Farnell; ComponentLink13URL: https://datasheet.octopart.com:443/C0603C104K5RAC-TU-Kemet-datasheet-5314969.pdf?src-supplier=Farnell; ComponentLink13Description: https://datasheet.octopart.com:443/C0603C104K5RAC-TU-Kemet-datasheet-5314969.pdf?src-supplier=Farnell; ComponentLink14URL: https://datasheet.octopart.com:443/C0603C104K5RAC-TU-Kemet-datasheet-5314627.pdf?src-supplier=Farnell; ComponentLink14Description: https://datasheet.octopart.com:443/C0603C104K5RAC-TU-Kemet-datasheet-5314627.pdf?src-supplier=Farnell; ComponentLink15URL: https://datasheet.octopart.com:443/C0603C104K5RAC-TU-Kemet-datasheet-5389132.pdf?src-supplier=Farnell; ComponentLink15Description: https://datasheet.octopart.com:443/C0603C104K5RAC-TU-Kemet-datasheet-5389132.pdf?src-supplier=Farnell; ComponentLink16URL: https://datasheet.octopart.com:443/C0603C104K5RAC-TU-Kemet-datasheet-5313836.pdf?src-supplier=Farnell; ComponentLink16Description: https://datasheet.octopart.com:443/C0603C104K5RAC-TU-Kemet-datasheet-5313836.pdf?src-supplier=Farnell; ComponentLink17URL: https://datasheet.octopart.com:443/C0603C104K5RAC-TU-Kemet-datasheet-8111010.pdf?src-supplier=Farnell; ComponentLink17Description: https://datasheet.octopart.com:443/C0603C104K5RAC-TU-Kemet-datasheet-8111010.pdf?src-supplier=Farnell; ComponentLink18URL: https://datasheet.octopart.com:443/C0603C104K5RAC-TU-Kemet-datasheet-7627733.pdf?src-supplier=Farnell; ComponentLink18Description: https://datasheet.octopart.com:443/C0603C104K5RAC-TU-Kemet-datasheet-7627733.pdf?src-supplier=Farnell; ComponentLink19URL: https://datasheet.octopart.com:443/C0603C104K5RAC-TU-Kemet-datasheet-5315946.pdf?src-supplier=Farnell; ComponentLink19Description: https://datasheet.octopart.com:443/C0603C104K5RAC-TU-Kemet-datasheet-5315946.pdf?src-supplier=Farnell; ComponentLink20URL: https://datasheet.octopart.com:443/C0603C104K5RACTU-KEMET-datasheet-137357764.pdf?src-supplier=Upverter; ComponentLink20Description: https://datasheet.octopart.com:443/C0603C104K5RACTU-KEMET-datasheet-137357764.pdf?src-supplier=Upverter; ComponentLink21URL: https://datasheet.octopart.com:443/C0603C104K5RAC-TU-Kemet-datasheet-5313890.pdf?src-supplier=Newark; ComponentLink21Description: https://datasheet.octopart.com:443/C0603C104K5RAC-TU-Kemet-datasheet-5313890.pdf?src-supplier=Newark; ComponentLink22URL: https://datasheet.octopart.com:443/C0603C104K5RACTU-Kemet-datasheet-12608295.pdf?src-supplier=Newark; ComponentLink22Description: https://datasheet.octopart.com:443/C0603C104K5RACTU-Kemet-datasheet-12608295.pdf?src-supplier=Newark; ComponentLink23URL: https://datasheet.octopart.com:443/C0603C104K5RACTU-Kemet-datasheet-11992184.pdf?src-supplier=Newark; ComponentLink23Description: https://datasheet.octopart.com:443/C0603C104K5RACTU-Kemet-datasheet-11992184.pdf?src-supplier=Newark; ComponentLink24URL: https://datasheet.octopart.com:443/C0603C104K5RACTU-Kemet-datasheet-10942409.pdf?src-supplier=Newark; ComponentLink24Description: https://datasheet.octopart.com:443/C0603C104K5RACTU-Kemet-datasheet-10942409.pdf?src-supplier=Newark; ComponentLink25URL: https://datasheet.octopart.com:443/C0603C104K5RACTU-Kemet-datasheet-10404442.pdf?src-supplier=Newark; ComponentLink25Description: https://datasheet.octopart.com:443/C0603C104K5RACTU-Kemet-datasheet-10404442.pdf?src-supplier=Newark; ComponentLink26URL: https://datasheet.octopart.com:443/C0603C104K5RAC-TU-Kemet-datasheet-5390537.pdf?src-supplier=Newark; ComponentLink26Description: https://datasheet.octopart.com:443/C0603C104K5RAC-TU-Kemet-datasheet-5390537.pdf?src-supplier=Newark; ComponentLink27URL: https://datasheet.octopart.com:443/C0603C104K5RAC-TU-Kemet-datasheet-7541751.pdf?src-supplier=Newark; ComponentLink27Description: https://datasheet.octopart.com:443/C0603C104K5RAC-TU-Kemet-datasheet-7541751.pdf?src-supplier=Newark; ComponentLink28URL: https://datasheet.octopart.com:443/C0603C104K5RACTU-KEMET-datasheet-171829795.pdf?src-supplier=Newark; ComponentLink28Description: https://datasheet.octopart.com:443/C0603C104K5RACTU-KEMET-datasheet-171829795.pdf?src-supplier=Newark; ComponentLink29URL: https://datasheet.octopart.com:443/C0603C104K5RACTU-Kemet-datasheet-8764837.pdf?src-supplier=Newark; ComponentLink29Description: https://datasheet.octopart.com:443/C0603C104K5RACTU-Kemet-datasheet-8764837.pdf?src-supplier=Newark; ComponentLink30URL: https://datasheet.octopart.com:443/C0603C104K5RACTU-Kemet-datasheet-8480123.pdf?src-supplier=Newark; ComponentLink30Description: https://datasheet.octopart.com:443/C0603C104K5RACTU-Kemet-datasheet-8480123.pdf?src-supplier=Newark; ComponentLink31URL: https://datasheet.octopart.com:443/C0603C104K5RACTU-Kemet-datasheet-5393970.pdf?src-supplier=Newark; ComponentLink31Description: https://datasheet.octopart.com:443/C0603C104K5RACTU-Kemet-datasheet-5393970.pdf?src-supplier=Newark; ComponentLink32URL: https://datasheet.octopart.com:443/C0603C104K5RACTU-Kemet-datasheet-8502025.pdf?src-supplier=Newark; ComponentLink32Description: https://datasheet.octopart.com:443/C0603C104K5RACTU-Kemet-datasheet-8502025.pdf?src-supplier=Newark; ComponentLink33URL: https://datasheet.octopart.com:443/C0603C104K5RACTU-Kemet-datasheet-161801.pdf?src-supplier=Newark; ComponentLink33Description: https://datasheet.octopart.com:443/C0603C104K5RACTU-Kemet-datasheet-161801.pdf?src-supplier=Newark; ComponentLink34URL: https://datasheet.octopart.com:443/C0603C104K5RACTU-Kemet-datasheet-32036385.pdf?src-supplier=Electro+Sonic; ComponentLink34Description: https://datasheet.octopart.com:443/C0603C104K5RACTU-Kemet-datasheet-32036385.pdf?src-supplier=Electro+Sonic; ComponentLink35URL: https://datasheet.octopart.com:443/C0603C104K5RACTU-KEMET-datasheet-157246124.pdf?src-supplier=Electro+Sonic; ComponentLink35Description: https://datasheet.octopart.com:443/C0603C104K5RACTU-KEMET-datasheet-157246124.pdf?src-supplier=Electro+Sonic; ComponentLink36URL: https://datasheet.octopart.com:443/C0603C104K5RACTU-KEMET-datasheet-164512540.pdf?src-supplier=TME; ComponentLink36Description: https://datasheet.octopart.com:443/C0603C104K5RACTU-KEMET-datasheet-164512540.pdf?src-supplier=TME; ComponentLink37URL: https://datasheet.octopart.com:443/C0603C104K5RACTU-Kemet-datasheet-67830781.pdf?src-supplier=TME; ComponentLink37Description: https://datasheet.octopart.com:443/C0603C104K5RACTU-Kemet-datasheet-67830781.pdf?src-supplier=TME; ComponentLink38URL: https://datasheet.octopart.com:443/C0603C104K5RACTU-KEMET-datasheet-68331906.pdf?src-supplier=TME; ComponentLink38Description: https://datasheet.octopart.com:443/C0603C104K5RACTU-KEMET-datasheet-68331906.pdf?src-supplier=TME; ComponentLink39URL: https://datasheet.octopart.com:443/C0603C104K5RAC7867-Kemet-datasheet-62098571.pdf?src-supplier=TME; ComponentLink39Description: https://datasheet.octopart.com:443/C0603C104K5RAC7867-Kemet-datasheet-62098571.pdf?src-supplier=TME; ComponentLink40URL: https://datasheet.octopart.com:443/C0603C104K5RAC7867-Kemet-datasheet-17577222.pdf?src-supplier=TME; ComponentLink40Description: https://datasheet.octopart.com:443/C0603C104K5RAC7867-Kemet-datasheet-17577222.pdf?src-supplier=TME; ComponentLink41URL: https://datasheet.octopart.com:443/C0603C104K5RACTU-KEMET-datasheet-110724412.pdf?src-supplier=RS+(Formerly+Allied+Electronics); ComponentLink41Description: https://datasheet.octopart.com:443/C0603C104K5RACTU-KEMET-datasheet-110724412.pdf?src-supplier=RS+(Formerly+Allied+Electronics); ComponentLink42URL: https://datasheet.octopart.com:443/C0603C104K5RACTU-Kemet-datasheet-464.pdf?src-supplier=RS+(Formerly+Allied+Electronics); ComponentLink42Description: https://datasheet.octopart.com:443/C0603C104K5RACTU-Kemet-datasheet-464.pdf?src-supplier=RS+(Formerly+Allied+Electronics); ComponentLink43URL: https://datasheet.octopart.com/C0603C104K5RACTU-KEMET-datasheet-84169754.pdf; ComponentLink43Description: https://datasheet.octopart.com/C0603C104K5RACTU-KEMET-datasheet-84169754.pdf; ComponentLink44URL: https://datasheet.octopart.com:443/C0603C104K5RACTU-Kemet-datasheet-24570007.pdf?src-supplier=element14+APAC; ComponentLink44Description: https://datasheet.octopart.com:443/C0603C104K5RACTU-Kemet-datasheet-24570007.pdf?src-supplier=element14+APAC; ComponentLink45URL: https://datasheet.octopart.com:443/C0603C104K5RACTU-Kemet-datasheet-22084244.pdf?src-supplier=element14+APAC; ComponentLink45Description: https://datasheet.octopart.com:443/C0603C104K5RACTU-Kemet-datasheet-22084244.pdf?src-supplier=element14+APAC; ComponentLink46URL: https://datasheet.octopart.com:443/C0603C104K5RACTU-Kemet-datasheet-21389238.pdf?src-supplier=element14+APAC; ComponentLink46Description: https://datasheet.octopart.com:443/C0603C104K5RACTU-Kemet-datasheet-21389238.pdf?src-supplier=element14+APAC; ComponentLink47URL: https://datasheet.octopart.com:443/C0603C104K5RACTU-Kemet-datasheet-11723057.pdf?src-supplier=Arrow+Electronics; ComponentLink47Description: https://datasheet.octopart.com:443/C0603C104K5RACTU-Kemet-datasheet-11723057.pdf?src-supplier=Arrow+Electronics; ComponentLink48URL: https://datasheet.octopart.com:443/C0603C104K5RAC7867-KEMET-datasheet-164857143.pdf?src-supplier=Burklin+Elektronik; ComponentLink48Description: https://datasheet.octopart.com:443/C0603C104K5RAC7867-KEMET-datasheet-164857143.pdf?src-supplier=Burklin+Elektronik; ComponentLink49URL: https://datasheet.octopart.com:443/C0603C104K5RAC-TU-Kemet-datasheet-8187850.pdf?src-supplier=Jameco; ComponentLink49Description: https://datasheet.octopart.com:443/C0603C104K5RAC-TU-Kemet-datasheet-8187850.pdf?src-supplier=Jameco; ComponentLink50URL: https://datasheet.octopart.com:443/C0603C104K5RACTU-Kemet-datasheet-122295.pdf?src-supplier=DigiKey; ComponentLink50Description: https://datasheet.octopart.com:443/C0603C104K5RACTU-Kemet-datasheet-122295.pdf?src-supplier=DigiKey
C80 = GJM1555C1HR10WB01D: Multilayer Ceramic Capacitor, 0.1 pF, 50 V, ± 0.05pF, C0G (NP0), 0402 [1005 Metric]; Manufacturer: Murata; Manufacturer Lifecycle Status: IN PRODUCTION; Temperature Coefficient: 30ppm/°C; Supplier: DigiKey; Supplier Part Number: 490-11246-1-ND; Manufacturer Part Number: GJM1555C1HR10WB01D; RoHS: Compliant; Category: Ceramic Capacitors; Stock: 158749; Pricing: 1=0.13, 10=0.073, 50=0.0506, 100=0.044, 500=0.03276, 1000=0.02931, 2500=0.02674, 5000=0.02514 (USD); Case/Package: 0402; Case Code (Imperial): 0402; Case Code (Metric): 1005; Dielectric: C0G; Dielectric Material: Ceramic; Export Control Classification Number (ECCN) Code: EAR99; Height: 500µm; Harmonized Tariff Schedule (HTS) Code: 8532.24.00.20; Introduction Date: 2008-02-22; Lead Free: Lead Free; Length: 1mm; Lifecycle Status: Production; Material: Ceramic; Max Operating Temperature: 125°C; Min Operating Temperature: -55°C; Mounting Technology: Surface Mount; Number of Terminals: 2; REACH SVHC: Yes; Schedule B: 8532240020, 8532240020|8532240020|8532240020|8532240020|8532240020; Termination: SMD/SMT; Thickness: 500µm; Voltage Rating (DC): 50V; Width: 500µm; ComponentLink1URL: https://datasheet.octopart.com:443/GJM1555C1HR10WB01D-Murata-datasheet-14406295.pdf?src-supplier=Future+Electronics; ComponentLink1Description: https://datasheet.octopart.com:443/GJM1555C1HR10WB01D-Murata-datasheet-14406295.pdf?src-supplier=Future+Electronics; ComponentLink2URL: https://datasheet.octopart.com:443/GJM1555C1HR10WB01D-Murata-datasheet-22122223.pdf?src-supplier=Future+Electronics; ComponentLink2Description: https://datasheet.octopart.com:443/GJM1555C1HR10WB01D-Murata-datasheet-22122223.pdf?src-supplier=Future+Electronics; ComponentLink3URL: https://datasheet.octopart.com:443/GJM1555C1HR10WB01D-Murata-datasheet-44104974.pdf?src-supplier=Future+Electronics; ComponentLink3Description: https://datasheet.octopart.com:443/GJM1555C1HR10WB01D-Murata-datasheet-44104974.pdf?src-supplier=Future+Electronics; ComponentLink4URL: https://datasheet.octopart.com:443/GJM1555C1HR10WB01D-Murata-datasheet-165579666.pdf?src-supplier=TME; ComponentLink4Description: https://datasheet.octopart.com:443/GJM1555C1HR10WB01D-Murata-datasheet-165579666.pdf?src-supplier=TME; ComponentLink5URL: https://datasheet.octopart.com:443/GJM1555C1HR10WB01D-Murata-datasheet-141271456.pdf?src-supplier=Ciiva; ComponentLink5Description: https://datasheet.octopart.com:443/GJM1555C1HR10WB01D-Murata-datasheet-141271456.pdf?src-supplier=Ciiva; ComponentLink6URL: https://datasheet.octopart.com:443/GJM1555C1HR10WB01D-Murata-datasheet-140665776.pdf?src-supplier=Ciiva; ComponentLink6Description: https://datasheet.octopart.com:443/GJM1555C1HR10WB01D-Murata-datasheet-140665776.pdf?src-supplier=Ciiva; ComponentLink7URL: https://datasheet.octopart.com:443/GJM1555C1HR10WB01D-Murata-datasheet-138725146.pdf?src-supplier=Ciiva; ComponentLink7Description: https://datasheet.octopart.com:443/GJM1555C1HR10WB01D-Murata-datasheet-138725146.pdf?src-supplier=Ciiva; ComponentLink8URL: https://datasheet.octopart.com/GJM1555C1HR10WB01D-Murata-datasheet-12515295.pdf; ComponentLink8Description: https://datasheet.octopart.com/GJM1555C1HR10WB01D-Murata-datasheet-12515295.pdf; ComponentLink9URL: https://datasheet.octopart.com/GJM1555C1HR10WB01D-Murata-datasheet-12510076.pdf; ComponentLink9Description: https://datasheet.octopart.com/GJM1555C1HR10WB01D-Murata-datasheet-12510076.pdf; ComponentLink10URL: https://datasheet.octopart.com/GJM1555C1HR10WB01D-Murata-datasheet-11978611.pdf; ComponentLink10Description: https://datasheet.octopart.com/GJM1555C1HR10WB01D-Murata-datasheet-11978611.pdf; ComponentLink11URL: https://datasheet.octopart.com/GJM1555C1HR10WB01D-Murata-datasheet-10025737.pdf; ComponentLink11Description: https://datasheet.octopart.com/GJM1555C1HR10WB01D-Murata-datasheet-10025737.pdf; ComponentLink12URL: https://datasheet.octopart.com/GJM1555C1HR10WB01D-Murata-datasheet-8819587.pdf; ComponentLink12Description: https://datasheet.octopart.com/GJM1555C1HR10WB01D-Murata-datasheet-8819587.pdf; ComponentLink13URL: http://sigma.octopart.com:80/reach_statement/Murata-company-16.pdf?src-supplier=Compliance+Statements; ComponentLink13Description: http://sigma.octopart.com:80/reach_statement/Murata-company-16.pdf?src-supplier=Compliance+Statements
C81 = GCM1885C1H332FA16D: 50V 3.3nF C0G ±1% 0603 Multilayer Ceramic Capacitors MLCC - SMD/SMT ROHS; Manufacturer: Murata; Manufacturer Lifecycle Status: IN PRODUCTION; Temperature Coefficient: 30ppm/°C; Supplier: DigiKey; Supplier Part Number: 490-GCM1885C1H332FA16DCT-ND; Manufacturer Part Number: GCM1885C1H332FA16D; RoHS: Compliant; Category: Ceramic Capacitors; Stock: 289814; Pricing: 1=0.18, 10=0.102, 50=0.072, 100=0.063, 500=0.04778, 1000=0.04311 (USD); Case/Package: 0603; Dielectric Material: Ceramic; Export Control Classification Number (ECCN) Code: EAR99; Height: 800µm; Harmonized Tariff Schedule (HTS) Code: 8532.24.00.20; Introduction Date: 2013-11-20; Length: 1.6mm; Lifecycle Status: Production; Material: Ceramic; Max Operating Temperature: 125°C; Min Operating Temperature: -55°C; Mounting Technology: Surface Mount; Number of Terminals: 2; REACH SVHC: Yes; Schedule B: 8532240020; Thickness: 800µm; Tolerance: 1%; Voltage Rating (DC): 50V; Width: 800µm; ComponentLink1URL: https://datasheet.octopart.com:443/GCM1885C1H332FA16D-Murata-datasheet-141266224.pdf?src-supplier=Ciiva; ComponentLink1Description: https://datasheet.octopart.com:443/GCM1885C1H332FA16D-Murata-datasheet-141266224.pdf?src-supplier=Ciiva; ComponentLink2URL: https://datasheet.octopart.com:443/GCM1885C1H332FA16D-Murata-datasheet-140657002.pdf?src-supplier=Ciiva; ComponentLink2Description: https://datasheet.octopart.com:443/GCM1885C1H332FA16D-Murata-datasheet-140657002.pdf?src-supplier=Ciiva; ComponentLink3URL: https://datasheet.octopart.com:443/GCM1885C1H332FA16D-Murata-datasheet-138716702.pdf?src-supplier=Ciiva; ComponentLink3Description: https://datasheet.octopart.com:443/GCM1885C1H332FA16D-Murata-datasheet-138716702.pdf?src-supplier=Ciiva; ComponentLink4URL: https://datasheet.octopart.com:443/GCM1885C1H332FA16D-Murata-datasheet-12511495.pdf?src-supplier=TME; ComponentLink4Description: https://datasheet.octopart.com:443/GCM1885C1H332FA16D-Murata-datasheet-12511495.pdf?src-supplier=TME; ComponentLink5URL: http://sigma.octopart.com:80/reach_statement/Murata-company-16.pdf?src-supplier=Compliance+Statements; ComponentLink5Description: http://sigma.octopart.com:80/reach_statement/Murata-company-16.pdf?src-supplier=Compliance+Statements
C82 = GRM155R61H474KE11D: 50V 470nF X5R ±10% 0402 Multilayer Ceramic Capacitors MLCC - SMD/SMT ROHS; Manufacturer: Murata; Manufacturer Lifecycle Status: IN PRODUCTION; Supplier: DigiKey; Supplier Part Number: 490-16354-1-ND; Manufacturer Part Number: GRM155R61H474KE11D; RoHS: Compliant; Category: Ceramic Capacitors; Stock: 345514; Pricing: 1=0.1, 10=0.048, 50=0.0326, 100=0.028, 500=0.02042, 1000=0.01807, 2500=0.01646, 5000=0.01478 (USD); Case/Package: 0402; Country of Origin: Philippines; Dielectric: X5R; Dielectric Material: Ceramic; Export Control Classification Number (ECCN) Code: EAR99; Height: 500µm; Harmonized Tariff Schedule (HTS) Code: 8532.24.00.20; Introduction Date: 2016-11-30; Length: 1mm; Lifecycle Status: Production; Material: Ceramic; Max Operating Temperature: 85°C; Min Operating Temperature: -55°C; Mounting Technology: Surface Mount; Number of Terminals: 2; REACH SVHC: Yes; Schedule B: 8532240020, 8532240020|8532240020, 8532240020|8532240020|8532240020, 8532240020|8532240020|8532240020|8532240020; Thickness: 500µm; Tolerance: 10%; Voltage Rating (DC): 50V; Width: 500µm; ComponentLink1URL: https://datasheet.octopart.com:443/GRM155R61H474KE11D-Murata-datasheet-149523035.pdf?src-supplier=Newark; ComponentLink1Description: https://datasheet.octopart.com:443/GRM155R61H474KE11D-Murata-datasheet-149523035.pdf?src-supplier=Newark; ComponentLink2URL: https://datasheet.octopart.com:443/GRM155R61H474KE11D-Murata-datasheet-165579666.pdf?src-supplier=TME; ComponentLink2Description: https://datasheet.octopart.com:443/GRM155R61H474KE11D-Murata-datasheet-165579666.pdf?src-supplier=TME; ComponentLink3URL: https://datasheet.octopart.com:443/GRM155R61H474KE11D-Murata-datasheet-141266224.pdf?src-supplier=Ciiva; ComponentLink3Description: https://datasheet.octopart.com:443/GRM155R61H474KE11D-Murata-datasheet-141266224.pdf?src-supplier=Ciiva; ComponentLink4URL: https://datasheet.octopart.com:443/GRM155R61H474KE11D-Murata-datasheet-140690652.pdf?src-supplier=Ciiva; ComponentLink4Description: https://datasheet.octopart.com:443/GRM155R61H474KE11D-Murata-datasheet-140690652.pdf?src-supplier=Ciiva; ComponentLink5URL: https://datasheet.octopart.com:443/GRM155R61H474KE11D-Murata-datasheet-138740827.pdf?src-supplier=Ciiva; ComponentLink5Description: https://datasheet.octopart.com:443/GRM155R61H474KE11D-Murata-datasheet-138740827.pdf?src-supplier=Ciiva; ComponentLink6URL: https://datasheet.octopart.com:443/GRM155R61H474KE11D-Murata-datasheet-118179445.pdf?src-supplier=LCSC; ComponentLink6Description: https://datasheet.octopart.com:443/GRM155R61H474KE11D-Murata-datasheet-118179445.pdf?src-supplier=LCSC; ComponentLink7URL: https://datasheet.octopart.com:443/GRM155R61H474KE11D-Murata-datasheet-99353828.pdf?src-supplier=Future+Electronics; ComponentLink7Description: https://datasheet.octopart.com:443/GRM155R61H474KE11D-Murata-datasheet-99353828.pdf?src-supplier=Future+Electronics; ComponentLink8URL: https://datasheet.octopart.com/GRM155R61H474KE11D-Murata-datasheet-12515295.pdf; ComponentLink8Description: https://datasheet.octopart.com/GRM155R61H474KE11D-Murata-datasheet-12515295.pdf; ComponentLink9URL: https://datasheet.octopart.com/GRM155R61H474KE11D-Murata-datasheet-12510076.pdf; ComponentLink9Description: https://datasheet.octopart.com/GRM155R61H474KE11D-Murata-datasheet-12510076.pdf; ComponentLink10URL: https://datasheet.octopart.com/GRM155R61H474KE11D-Murata-datasheet-11978611.pdf; ComponentLink10Description: https://datasheet.octopart.com/GRM155R61H474KE11D-Murata-datasheet-11978611.pdf; ComponentLink11URL: https://datasheet.octopart.com/GRM155R61H474KE11D-Murata-datasheet-10025737.pdf; ComponentLink11Description: https://datasheet.octopart.com/GRM155R61H474KE11D-Murata-datasheet-10025737.pdf; ComponentLink12URL: https://datasheet.octopart.com/GRM155R61H474KE11D-Murata-datasheet-8819587.pdf; ComponentLink12Description: https://datasheet.octopart.com/GRM155R61H474KE11D-Murata-datasheet-8819587.pdf; ComponentLink13URL: http://sigma.octopart.com:80/reach_statement/Murata-company-16.pdf?src-supplier=Compliance+Statements; ComponentLink13Description: http://sigma.octopart.com:80/reach_statement/Murata-company-16.pdf?src-supplier=Compliance+Statements